# Altium schematic sheet CoreOutline.SchDoc
size A
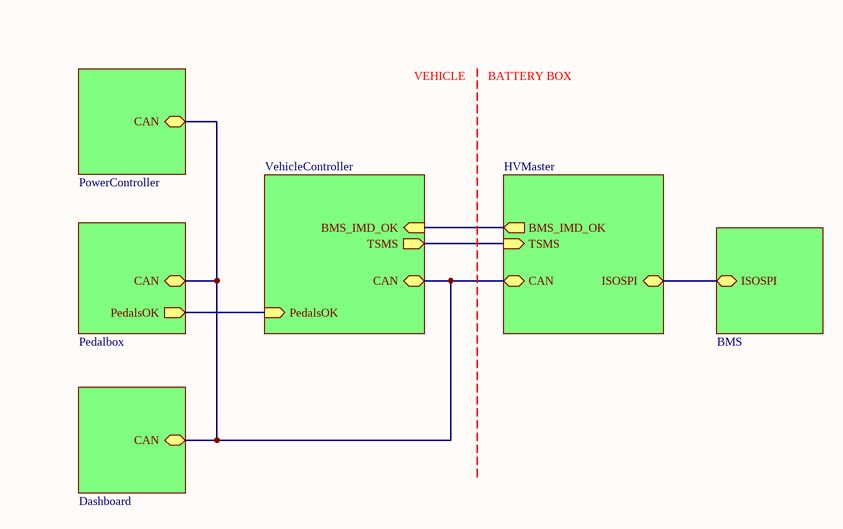
[diagram p0: CoreOutline.SchDoc]

## Sub-sheets
? = VehicleController: CAN (bidir), BMS_IMD_OK (in), TSMS (out), PedalsOK (in)
? = HVMaster: CAN (bidir), BMS_IMD_OK (out), ISOSPI (bidir), TSMS (in)
? = Dashboard: CAN (bidir)
? = Pedalbox: CAN (bidir), PedalsOK (out)
? = PowerController: CAN (bidir)
? = BMS: ISOSPI (bidir)

## Nets
(unnamed): sheet /CAN, sheet /CAN, sheet /CAN, sheet /CAN, sheet /CAN
(unnamed): sheet /BMS_IMD_OK, sheet /BMS_IMD_OK
(unnamed): sheet /TSMS, sheet /TSMS
(unnamed): sheet /PedalsOK, sheet /PedalsOK
(unnamed): sheet /ISOSPI, sheet /ISOSPI

## Notes on the sheet
- VEHICLE
- BATTERY BOX